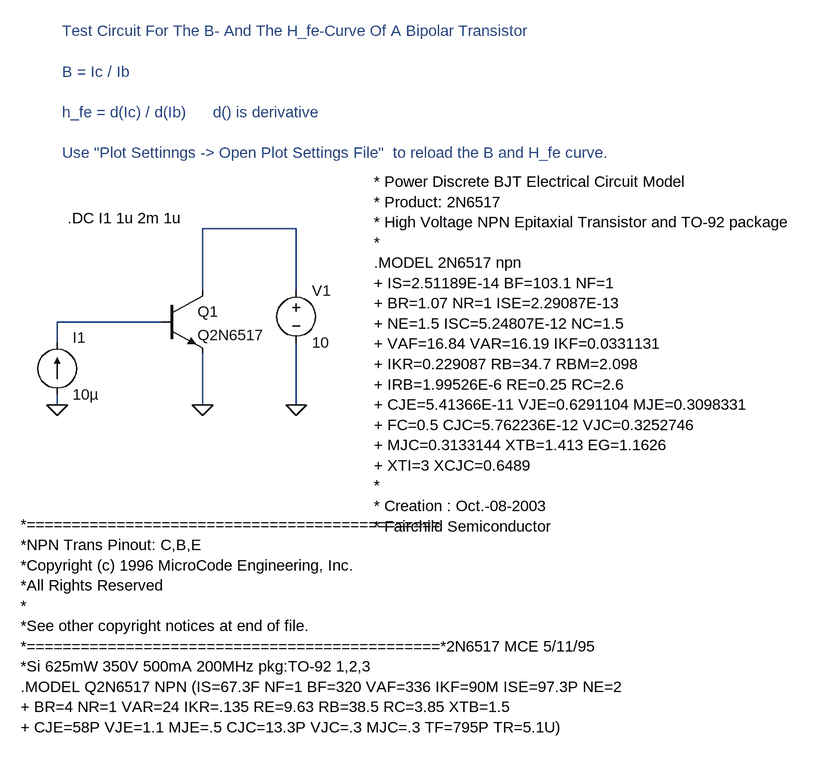
[diagram p0: schematic 2n6517.asc]
2n6517.asc, the LTspice schematic file:
Version 4
SHEET 1 1204 848
WIRE 176 288 176 368
WIRE 176 192 176 96
WIRE 320 192 320 96
WIRE 320 96 176 96
WIRE 320 272 320 368
WIRE 112 240 -48 240
WIRE -48 240 -48 272
WIRE -48 352 -48 368
FLAG 176 368 0
FLAG 320 368 0
FLAG -48 368 0
SYMBOL npn 112 192 R0
SYMATTR InstName Q1
SYMATTR Value Q2N6517
SYMBOL voltage 320 176 R0
SYMATTR InstName V1
SYMATTR Value 10
SYMBOL current -48 352 M180
WINDOW 0 24 88 Left 0
WINDOW 3 24 0 Left 0
SYMATTR InstName I1
SYMATTR Value 10µ
TEXT -32 80 Left 0 !.DC I1 1u 2m 1u
TEXT -104 552 Left 0 !*==============================================\n*NPN Trans Pinout: C,B,E\n*Copyright (c) 1996 MicroCode Engineering, Inc.\n*All Rights Reserved\n*\n*See other copyright notices at end of file.\n*==============================================*2N6517 MCE 5/11/95\n*Si 625mW 350V 500mA 200MHz pkg:TO-92 1,2,3\n.MODEL Q2N6517 NPN (IS=67.3F NF=1 BF=320 VAF=336 IKF=90M ISE=97.3P NE=2\n+ BR=4 NR=1 VAR=24 IKR=.135 RE=9.63 RB=38.5 RC=3.85 XTB=1.5\n+ CJE=58P VJE=1.1 MJE=.5 CJC=13.3P VJC=.3 MJC=.3 TF=795P TR=5.1U)
TEXT 440 24 Left 0 !* Power Discrete BJT Electrical Circuit Model\n* Product: 2N6517\n* High Voltage NPN Epitaxial Transistor and TO-92 package\n*\n.MODEL 2N6517 npn\n+ IS=2.51189E-14 BF=103.1 NF=1\n+ BR=1.07 NR=1 ISE=2.29087E-13\n+ NE=1.5 ISC=5.24807E-12 NC=1.5\n+ VAF=16.84 VAR=16.19 IKF=0.0331131\n+ IKR=0.229087 RB=34.7 RBM=2.098\n+ IRB=1.99526E-6 RE=0.25 RC=2.6\n+ CJE=5.41366E-11 VJE=0.6291104 MJE=0.3098331\n+ FC=0.5 CJC=5.762236E-12 VJC=0.3252746\n+ MJC=0.3133144 XTB=1.413 EG=1.1626\n+ XTI=3 XCJC=0.6489\n*\n* Creation : Oct.-08-2003\n* Fairchild Semiconductor
TEXT -40 -208 Left 0 ;Test Circuit For The B- And The H_fe-Curve Of A Bipolar Transistor\n \nB = Ic / Ib\n \nh_fe = d(Ic) / d(Ib)      d() is derivative\n \nUse "Plot Settinngs -> Open Plot Settings File"  to reload the B and H_fe curve.

The netlist it stands for:
* 2n6517.asc
Q1 N001 N002 0 0 Q2N6517
V1 N001 0 10
I1 0 N002 10µ
.model NPN NPN
.model PNP PNP
.lib standard.bjt
.DC I1 1u 2m 1u
*==============================================
*NPN Trans Pinout: C,B,E
*Copyright (c) 1996 MicroCode Engineering, Inc.
*All Rights Reserved
*
*See other copyright notices at end of file.
*==============================================*2N6517 MCE 5/11/95
*Si 625mW 350V 500mA 200MHz pkg:TO-92 1,2,3
.MODEL Q2N6517 NPN (IS=67.3F NF=1 BF=320 VAF=336 IKF=90M ISE=97.3P NE=2
+ BR=4 NR=1 VAR=24 IKR=.135 RE=9.63 RB=38.5 RC=3.85 XTB=1.5
+ CJE=58P VJE=1.1 MJE=.5 CJC=13.3P VJC=.3 MJC=.3 TF=795P TR=5.1U)
* Power Discrete BJT Electrical Circuit Model
* Product: 2N6517
* High Voltage NPN Epitaxial Transistor and TO-92 package
*
.MODEL 2N6517 npn
+ IS=2.51189E-14 BF=103.1 NF=1
+ BR=1.07 NR=1 ISE=2.29087E-13
+ NE=1.5 ISC=5.24807E-12 NC=1.5
+ VAF=16.84 VAR=16.19 IKF=0.0331131
+ IKR=0.229087 RB=34.7 RBM=2.098
+ IRB=1.99526E-6 RE=0.25 RC=2.6
+ CJE=5.41366E-11 VJE=0.6291104 MJE=0.3098331
+ FC=0.5 CJC=5.762236E-12 VJC=0.3252746
+ MJC=0.3133144 XTB=1.413 EG=1.1626
+ XTI=3 XCJC=0.6489
*
* Creation : Oct.-08-2003
* Fairchild Semiconductor
* Test Circuit For The B- And The H_fe-Curve Of A Bipolar Transistor
* B = Ic / Ib
* h_fe = d(Ic) / d(Ib)      d() is derivative
* Use "Plot Settinngs -> Open Plot Settings File"  to reload the B and H_fe curve.
.backanno
.end